# Altium schematic sheet SAML21_Xplained_Pro_current_measurement.SchDoc: Current measurement
size A3; Organization: ATMEL Norway; Address1: Vestre Rosten 79; Address2: N-7075 TILLER; Address3: NORWAY; DocumentNumber: A09-2241; Revision: 4; SheetNumber: 6; SheetTotal: 10; PageSetup: Record=PageOptions|CenterHorizontal=True|CenterVertical=True|PrintScale=1.01|XCorrection=1.00|YCorrection=1.00|PrintKind=1|BorderSize=5000000|LeftOffset=0|BottomOffset=0|Orientation=2|PaperLength=1000|PaperWidth=1000|Scale=100|PaperSource=7|PrintQuality=-4|MediaType=1|DitherType=10|PaperKind=A3 (297 x 420 mm)|PrintScaleMode=1
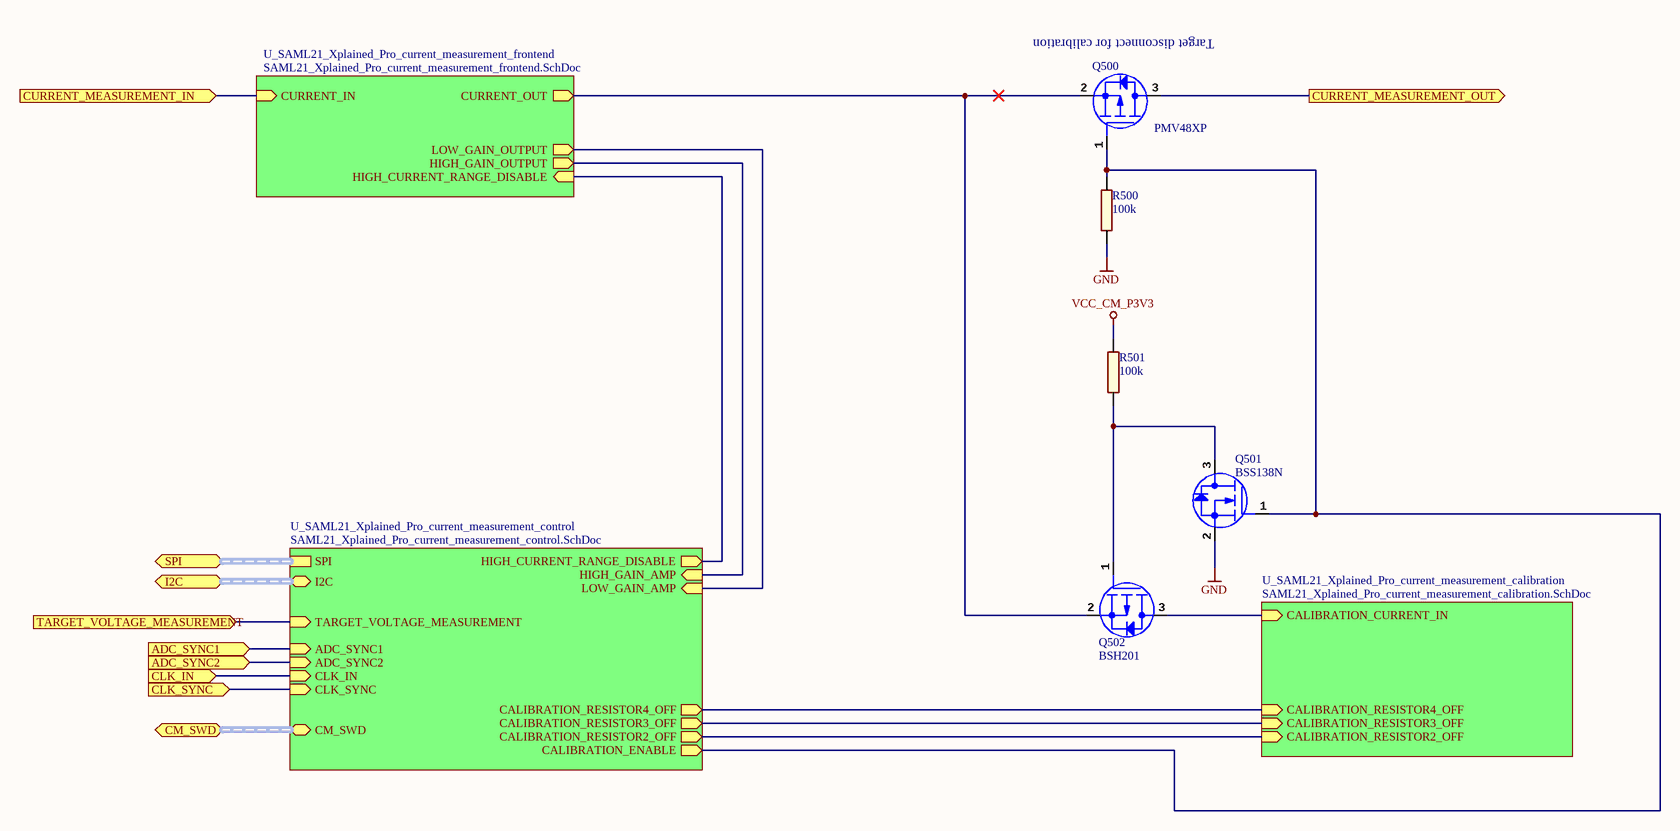
[diagram p0: SAML21_Xplained_Pro_current_measurement.SchDoc]

## Parts
Q500  value PMV48XP  [AP5-00002]  (hidden comment: MOSFET_P_GSD)
Q501  value BSS138N  [AP5-00002]  (hidden comment: MOSFET_N_GSD)
Q502  value BSH201  [AP5-00002]  (hidden comment: MOSFET_P_GSD)
R500  value 100k  [AP2-00011]  (hidden comment: R2)
R501  value 100k  [AP2-00011]  (hidden comment: R2)

## Sub-sheets
U_SAML21_Xplained_Pro_current_measurement_calibration = SAML21_Xplained_Pro_current_measurement_calibration.SchDoc: CALIBRATION_RESISTOR2_OFF (in), CALIBRATION_RESISTOR3_OFF (in), CALIBRATION_RESISTOR4_OFF (in), CALIBRATION_CURRENT_IN (in)
U_SAML21_Xplained_Pro_current_measurement_control = SAML21_Xplained_Pro_current_measurement_control.SchDoc: LOW_GAIN_AMP (in), HIGH_GAIN_AMP (in), HIGH_CURRENT_RANGE_DISABLE (out), SPI (harness SPI), CALIBRATION_RESISTOR3_OFF (out), CALIBRATION_RESISTOR2_OFF (out), CALIBRATION_ENABLE (out), CALIBRATION_RESISTOR4_OFF (out), I2C (harness I2C), ADC_SYNC1 (in), ADC_SYNC2 (in), CLK_IN (in), CLK_SYNC (in), TARGET_VOLTAGE_MEASUREMENT (in), CM_SWD (harness SWD)
U_SAML21_Xplained_Pro_current_measurement_frontend = SAML21_Xplained_Pro_current_measurement_frontend.SchDoc: CURRENT_OUT (out), CURRENT_IN (in), LOW_GAIN_OUTPUT (out), HIGH_GAIN_OUTPUT (out), HIGH_CURRENT_RANGE_DISABLE (in)

## Ports
ADC_SYNC1 (in), ADC_SYNC2 (in), CLK_IN (in), CLK_SYNC (in), CM_SWD (harness SWD), CURRENT_MEASUREMENT_IN (in), CURRENT_MEASUREMENT_OUT (out), I2C (harness I2C), SPI (harness SPI), TARGET_VOLTAGE_MEASUREMENT (in)

## Nets
GND: Q501.2(S) R500.1
VCC_CM_P3V3: R501.2
ADC_SYNC1: port ADC_SYNC1, sheet U_SAML21_Xplained_Pro_current_measurement_control/ADC_SYNC1
ADC_SYNC2: port ADC_SYNC2, sheet U_SAML21_Xplained_Pro_current_measurement_control/ADC_SYNC2
CLK_IN: port CLK_IN, sheet U_SAML21_Xplained_Pro_current_measurement_control/CLK_IN
CLK_SYNC: port CLK_SYNC, sheet U_SAML21_Xplained_Pro_current_measurement_control/CLK_SYNC
CURRENT_MEASUREMENT_IN: port CURRENT_MEASUREMENT_IN, sheet U_SAML21_Xplained_Pro_current_measurement_frontend/CURRENT_IN
CURRENT_MEASUREMENT_OUT: Q500.3(D) ; port CURRENT_MEASUREMENT_OUT
TARGET_VOLTAGE_MEASUREMENT: port TARGET_VOLTAGE_MEASUREMENT, sheet U_SAML21_Xplained_Pro_current_measurement_control/TARGET_VOLTAGE_MEASUREMENT
NetQ500_1: Q500.1(G) Q501.1(G) R500.2 ; sheet U_SAML21_Xplained_Pro_current_measurement_control/CALIBRATION_ENABLE
NetQ500_2: Q500.2(S) Q502.2(S) ; sheet U_SAML21_Xplained_Pro_current_measurement_frontend/CURRENT_OUT
NetQ501_3: Q501.3(D) Q502.1(G) R501.1
NetQ502_3: Q502.3(D) ; sheet U_SAML21_Xplained_Pro_current_measurement_calibration/CALIBRATION_CURRENT_IN
(unnamed): sheet U_SAML21_Xplained_Pro_current_measurement_calibration/CALIBRATION_RESISTOR2_OFF, sheet U_SAML21_Xplained_Pro_current_measurement_control/CALIBRATION_RESISTOR2_OFF
(unnamed): sheet U_SAML21_Xplained_Pro_current_measurement_calibration/CALIBRATION_RESISTOR3_OFF, sheet U_SAML21_Xplained_Pro_current_measurement_control/CALIBRATION_RESISTOR3_OFF
(unnamed): sheet U_SAML21_Xplained_Pro_current_measurement_calibration/CALIBRATION_RESISTOR4_OFF, sheet U_SAML21_Xplained_Pro_current_measurement_control/CALIBRATION_RESISTOR4_OFF
(unnamed): sheet U_SAML21_Xplained_Pro_current_measurement_control/LOW_GAIN_AMP, sheet U_SAML21_Xplained_Pro_current_measurement_frontend/LOW_GAIN_OUTPUT
(unnamed): sheet U_SAML21_Xplained_Pro_current_measurement_control/HIGH_GAIN_AMP, sheet U_SAML21_Xplained_Pro_current_measurement_frontend/HIGH_GAIN_OUTPUT
(unnamed): sheet U_SAML21_Xplained_Pro_current_measurement_control/HIGH_CURRENT_RANGE_DISABLE, sheet U_SAML21_Xplained_Pro_current_measurement_frontend/HIGH_CURRENT_RANGE_DISABLE

## Buses and harness runs
harness port CM_SWD = sheet U_SAML21_Xplained_Pro_current_measurement_control/CM_SWD
harness port I2C = sheet U_SAML21_Xplained_Pro_current_measurement_control/I2C
harness port SPI = sheet U_SAML21_Xplained_Pro_current_measurement_control/SPI

## Notes on the sheet
- (near Q500) Target disconnect for calibration
- Date:
- PAGE:
- of
- TITLE:
- Document number:
- Revision:

## Library data of the parts
Q500 = A05-0130: P-Channel Digital FET. -30V, -3.5A continuous, -14A Peak. RDS(ON)=48mOhm@VGS=-4.5V, RDS(ON)=71mOhm@VGS=-2.5V. VGS(th)<1.25V; PartGroup: Transistors,Power FET,SMD; Manufacturer: NXP; MPN: PMV48XP,215; TemperatureRange: -55Â°C to +150Â°C; AN: A05-0130
Q501 = A05-0140: Low leakage N-Channel MOSFET. 60V, 0.23A continuous, 0.92A Peak. RDS(ON) = 3.5Ohm@VGS=4.5V, VGS(th)<1.4V; PartGroup: Transistors,Small signal FET,SMD; Manufacturer: Infineon; TemperatureRange: -55  to +150 deg celcius; AN: A05-0140; Height: 1.10000002384186; MPN: BSS138N
Q502 = A05-0132: P-Channel Digital FET. -60V, -0.3A continuous, -1.2A Peak. RDS(ON)=2.5@VGS=-10V, RDS(ON)=<5 ohm @VGS=-2.5V. VGS(th)<1.9V; PartGroup: Transistors,Small signal FET,SMD; Manufacturer: NXP; MPN: BSH201,215; AN: A05-0132
R500 R501 = A02-0260: Thick film resistor, SMD 0402, 1/16W, 1%; PartGroup: Resistors,SMD,0402 1%; TemperatureRange: -55ï¿½ to +125ï¿½C; AN: A02-0260; Tolerance: 1 %; Height: 0,349999994039536